# Altium schematic sheet Switch PCB Schematic.SchDoc
size A
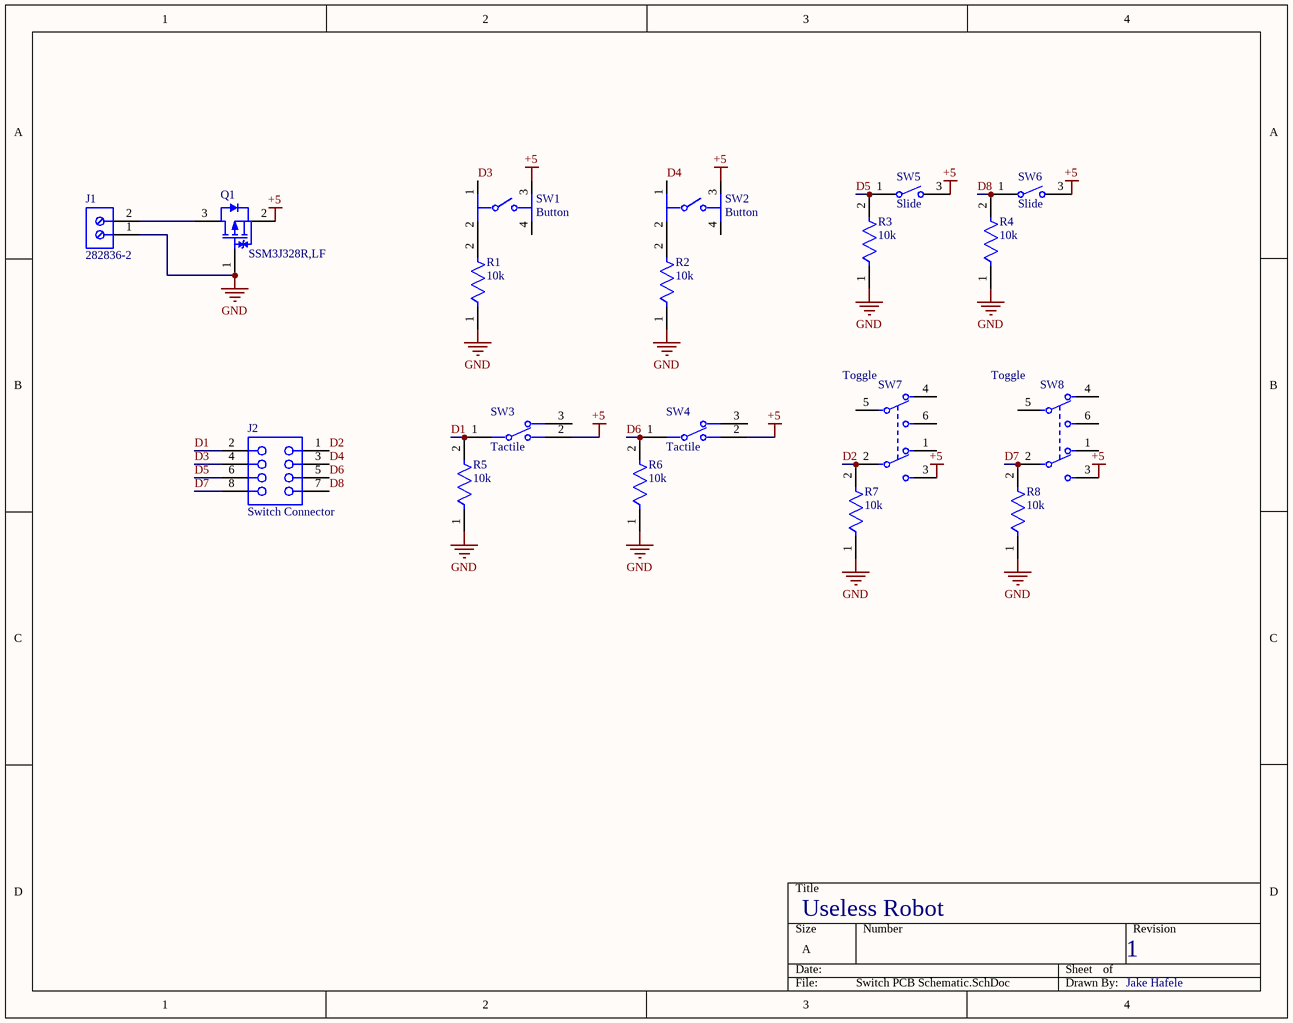
[diagram p0: Switch PCB Schematic.SchDoc]

## Parts
J1  282836-2  [TECO-282836-2_V]
J2  Switch Connector  [SMTC-SSW-104-01-X-D]
Q1  SSM3J328R,LF  [TOSH-SOT-23F_V]
R1  10k  [FP-RT1206-MFG]
R2  10k  [FP-RT1206-MFG]
R3  10k  [FP-RT1206-MFG]
R4  10k  [FP-RT1206-MFG]
R5  10k  [FP-RT1206-MFG]
R6  10k  [FP-RT1206-MFG]
R7  10k  [FP-RT1206-MFG]
R8  10k  [FP-RT1206-MFG]
SW1  Button  [FP-1825910-2-0]
SW2  Button  [FP-1825910-2-0]
SW3  Tactile  [FP-SS-5GL2D-MFG]
SW4  Tactile  [FP-SS-5GL2D-MFG]
SW5  Slide  [CKCP-TS02CBE_V]
SW6  Slide  [CKCP-TS02CBE_V]
SW7  Toggle  [FP-100DP1T2B3M2QEH-MFG]
SW8  Toggle  [FP-100DP1T2B3M2QEH-MFG]

## Nets
+5: Q1.2(S) SW1.3 SW2.3 SW3.2(NO) SW4.2(NO) SW5.3 SW6.3 SW7.3 SW8.3
GND: J1.1 Q1.1(G) R1.1 R2.1 R3.1 R4.1 R5.1 R6.1 R7.1 R8.1
\: J2.7 R4.2 SW6.1  [also labelled D8]
D1: J2.2 R5.2 SW3.1(COM)
D2: J2.1 R7.2 SW7.2
D3: J2.4 SW1.1
D4: J2.3 SW2.1
D5: J2.6 R3.2 SW5.1
D6: J2.5 R6.2 SW4.1(COM)
D7: J2.8 R8.2 SW8.2
NetJ1_2: J1.2 Q1.3(D)
NetR1_2: R1.2 SW1.2
NetR2_2: R2.2 SW2.2

Not connected (* = marked no-connect by the designer): SW1 4; SW2 4; SW3 3(NC); SW4 3(NC); SW7 1 4 5 6; SW8 1 4 5 6

## Notes on the sheet
- Useless Robot
- 1
- Jake Hafele

## Library data of the parts
J1 = CMP-1684-00017-1: Female Header, Pitch 5 mm, 1 x 2 Position, Height 10 mm, Tail Length 3.5 mm, Rohs, Bulk; Manufacturer: TE Connectivity; Wire Gauge: 16-30AWG; Product Training Modules: Wire-to-BoardEurostyleTerminalBlocks; Clamp Material - Plating: Brass-NickelPlated; Voltage: 300V; Mating Orientation: HorizontalwithBoard; Current: 13.5A; Pitch: 0.197"(5.00mm); Screw Thread: M3; 3D Model: 282836-2.pdf; Other Names: 5ULV-02B / A98076; Dynamic Catalog: BuchananSeries; Number of Levels: 1; Torque - Screw: 0.68Nm(6Lb-In); Featured Product: EurostyleTerminalBlockConnectors; Positions Per Level: 2; Wire Termination: Screw-RisingCageClamp; Datasheet URL: http://www.te.com.cn/commerce/DocumentDelivery/DDEController?Action=showdoc&DocId=Catalog+Section%7F1308389_EUROSTYLE_TERMINAL_BLOCKS%7F0607%7Fpdf%7FEnglish%7FENG_CS_1308389_EUROSTYLE_TERMINAL_BLOCKS_0607.pdf%7F282836-2; Color: Green; Family: TerminalBlocks-WiretoBoard; RoHS Information: 282836-2StatementofCompliance; Standard Package: 300; Contact Material - Plating: Brass-TinPlated; Manufacturer URL: http://www.te.com; Housing Material: Polyamide(PA66),Nylon6/6; Features: Interlocking(Side); Package Description: Female Header, Pitch 5 mm, 1 x 2 Position, Height 10 mm, Tail Length 3.5 mm; Mounting Type: ThroughHole; Package Reference: THD; Packaging: Bulk; Series: Buchanan; Category: Connectors,Interconnects; Screw Material - Plating: Brass-NickelPlated
J2 = CMP-1023-00339-1: SQ Post Socket, Through-hole, Vertical, -55 to 105 degC, 2.54mm Pitch, 8-Pin, Female, RoHS; PartNumber: SSW-104-01-T-D; Manufacturer: Samtec; ComponentLink1Description: Manufacturer URL; ComponentLink3Description: Package Specification; ComponentLink2Description: Datasheet; DatasheetVersion: F-214; PackageDescription: Assembly, Socket Strip .016 X .031 Tail; ComponentLink3URL: http://www.samtec.com/documents/webfiles/cpdf/SSW-1XX-XX-XXX-X-XX-XXX-XX-MKT.pdf; PackageReference: SSW-104-01-X-D; PackageVersion: CA, 6/1987; ComponentLink1URL: http://www.samtec.com; ComponentLink2URL: http://www.samtec.com/documents/webfiles/pdf/SSW_TH.PDF; Temperature Range: -55 to 105 degC; Orientation: Vertical; RoHS: True; Mounting Technology: Through-hole; Pitch: 2.54 mm
Q1 = CMP-2100-03686-1: TOSHIBA Field-Effect Transistor Silicon P-Channel MOS Type (U-MOS VI), 20 V, -55 to 125 degC, 3-Pin SOTFL, RoHS, Tape and Reel; Gate to Source Voltage (Vgs): 8V; Drain to Source Breakdown Voltage: -20V; Turn-Off Delay Time: 107ns; Continuous Drain Current (ID): 6A; Rds On Max: 29.8mOhm; Number of Elements: 1; Turn-On Delay Time: 32ns; Drain to Source Resistance: 47.4mOhm; Drain to Source Voltage (Vdss): 20V; Power Dissipation: 2W; Element Configuration: Single; Max Power Dissipation: 1W; Input Capacitance: 840pF; Manufacturer URL: http://www.toshiba.com/; Number of Pins: 3; Number of Channels: 1; Max Operating Temperature: 150degC; Min Operating Temperature: -55degC; Manufacturer: Toshiba; Mount: SurfaceMount; Package Description: 3-Pin Small Outline Transistor, Flat Lead, Body 2.9 x 1.8 mm, Pitch 0.95 mm; Radiation Hardening: No; Package Quantity: 3000; Package Reference: SOT-23F; RoHSCompliant: true; Package URL: https://toshiba.semicon-storage.com/ap-en/design-support/package/detail.SOT-23F.html; Packaging: TapeandReel; Datasheet Version: 41699.0; Case/Package: SOT-23-3; Datasheet URL: https://toshiba.semicon-storage.com/info/docget.jsp?did=2429&prodName=SSM3J328R
R1-R8 = CMP-2003-04268-2: RES SMD 10K OHM 0.5% 1/4W 1206; Manufacturer Part Number: RT1206DRE0710KL; Manufacturer: Yageo; Power Rating: 0.25W; Tolerance: 0.0001; Voltage Rating: 200V; Value: 10KΩ; Temperature Coefficient: 50 ppm/°C; Ipc Land Pattern Name: RESC310160X55; Device Class L1: Passive Components; Temperature: -55°C to +155°C; Series: RT; ComponentLink2URL: http://www.yageo.com/documents/recent/PYu-RT_1-to-0.01_RoHS_L_9.pdf; Device Class L3: Chip SMD Resistors; Category: Res; Footprint Url: http://www.yageo.com/exep/pages/download/literatures/PYu-R_Mount_10.pdf; Digikey Description: RES SMD 10K OHM 0.5% 1/4W 1206; ComponentLink2Description: Datasheet; Temperature Range Low: -55°C; Device Class L2: Resistors; Octopart: https://octopart.com/rt1206dre0710kl-yageo-1219301; Temperature Range High: +155°C; Lead Free: Yes; Composition: Thin Film; Height: 0.65mm; Resistance: 10KΩ; Package: RT1206; RoHS: TRUE; Automotive: No
SW1 SW2 = CMP-03407-000004-1: SWITCH TACTILE SPST-NO 0.05A 24V. Push button; Manufacturer: TE; Manufacturer Part Number: 1825910-2; Contact Current Rating: 50mA; Operating Force: 160gf; Contact Resistance: 100mΩ; Electromechanical Life: 100000Cycles; Voltage Rating Dc: 24V; Package: 0; ComponentLink2Description: Datasheet; Digikey Description: SWITCH TACTILE SPST-NO 0.05A 24V; Octopart: https://octopart.com/1825910-2-te+connectivity-42270502; Temperature Range Low: -35°C; Temperature Range High: +85°C; Lead Free: Yes; Device Class L2: Switches; Automotive: No; Temperature: -35°C to +85°C; Device Class L1: Electromechanical; Category: Switch; ComponentLink2URL: https://www.te.com/commerce/DocumentDelivery/DDEController?Action=showdoc&DocId=Customer+Drawing%7F1825910%7FC10%7Fpdf%7FEnglish%7FENG_CD_1825910_C10.pdf%7F1825910-2; Mount: Through Hole; RoHS: TRUE; Height: 4.6mm; Device Class L3: Tactile Switches; Throw Configuration: SPST-NO
SW3 SW4 = CMP-08833-000010-1: SWITCH SNAP ACTION SPDT 5A 125V. Snap Action; Actuator Material: Stainless Steel; Mechanical Life: 30000000Cycles; Switch Function: On-Mom; Overtravel: 0.047inch; Operating Position: 0.571inch; Max Voltage Rating (AC): 125V; Ratings: IP40; Voltage Rating (DC): 30V; Differential Travel: 0.031inch; Operating Force: 0.49N; Max Voltage Rating (DC): 14V; Electrical Life: 200000Cycles; Lead Free: Lead Free; Contact Material: Silver; Package Quantity: 500; REACH SVHC: No SVHC; Depth: 6.4mm; Max Operating Temperature: 85°C; Termination: PC Pins; Min Operating Temperature: -25°C; Mount: Through Hole; Max Current Rating: 5A; Current Rating: 5A; Contact Current Rating: 5A; Throw Configuration: SPDT; Voltage Rating (AC): 125V; Orientation: Straight; Length: 19.8mm; Packaging: Bulk
SW5 SW6 = CMP-2000-07317-1: Tiny Slide Switch, SPST, 20 V, -30 to 85 degC, 2-Pin THD, RoHS, Bulk Slide Switch; Manufacturer: C&K Components; Product Height (mm): 12.91mm; Actuator Style: TopSlide; Product Length (mm): 10.16mm; Switch Configuration: OFFNoneON; AC Voltage Rating (Max): 20V; Product Depth (mm): 5.08mm; Actuator Material: Nylon; Mounting Technology: ThroughHole; Manufacturer URL: http://www.ckswitches.com/; Type: Tiny; Pole Throw Configuration: SPST; Terminal Type: PCPins; Package Reference: TS02CBE; Package Description: 2-Pin Through Hole Device, Body 10.16 x 5.08 mm; Datasheet Version: 02/2016; Datasheet URL: http://www.ck-components.com/media/1426/ts_12feb16.pdf; Contact Material: CopperAlloy; Housing Material: N/A/StainlessSteel; Operating Temp Range: -30Cto85C; Contact Plating: Gold/Nickel; DC Voltage Rating (Max): 20V; Mounting Style: ThroughHole
SW7 SW8 = CMP-17880-000002-1: SWITCH TOGGLE NON ILLUMINATED. Double Pole Single Throw; Manufacturer: E-Switch; Manufacturer Part Number: 100DP1T2B3M2QEH; Contact Current Rating: 5A; Electromechanical Life: 40000Cycles; Contact Resistance: 10mΩ; Voltage Rating Ac: 120V; Throw Configuration: DPDT; Voltage Rating Dc: 28V; ComponentLink2Description: Datasheet; Height: 23.6mm; Temperature Range Low: -30°C; RoHS: TRUE; Package: 0; Category: Switch; Mouser Description: Toggle Switches 5A 120VAC/28VDC On-None-On PC Mnt; ComponentLink2URL: http://spec_sheets.e-switch.com/specs/ST121094.pdf; Lead Free: Yes; Device Class L2: Switches; Digikey Description: SWITCH TOGGLE NON ILLUMINATED; Temperature: -30°C to +85°C; Footprint Url: http://spec_sheets.e-switch.com/specs/ST121094.pdf; Automotive: No; Temperature Range High: +85°C; Device Class L3: Toggle Switches; Octopart: https://octopart.com/100dp1t2b3m2qeh-e-switch-7054946; Mount: Through Hole; Device Class L1: Electromechanical